# EAGLE schematic GabozePocaio (EAGLE 9.0.0)
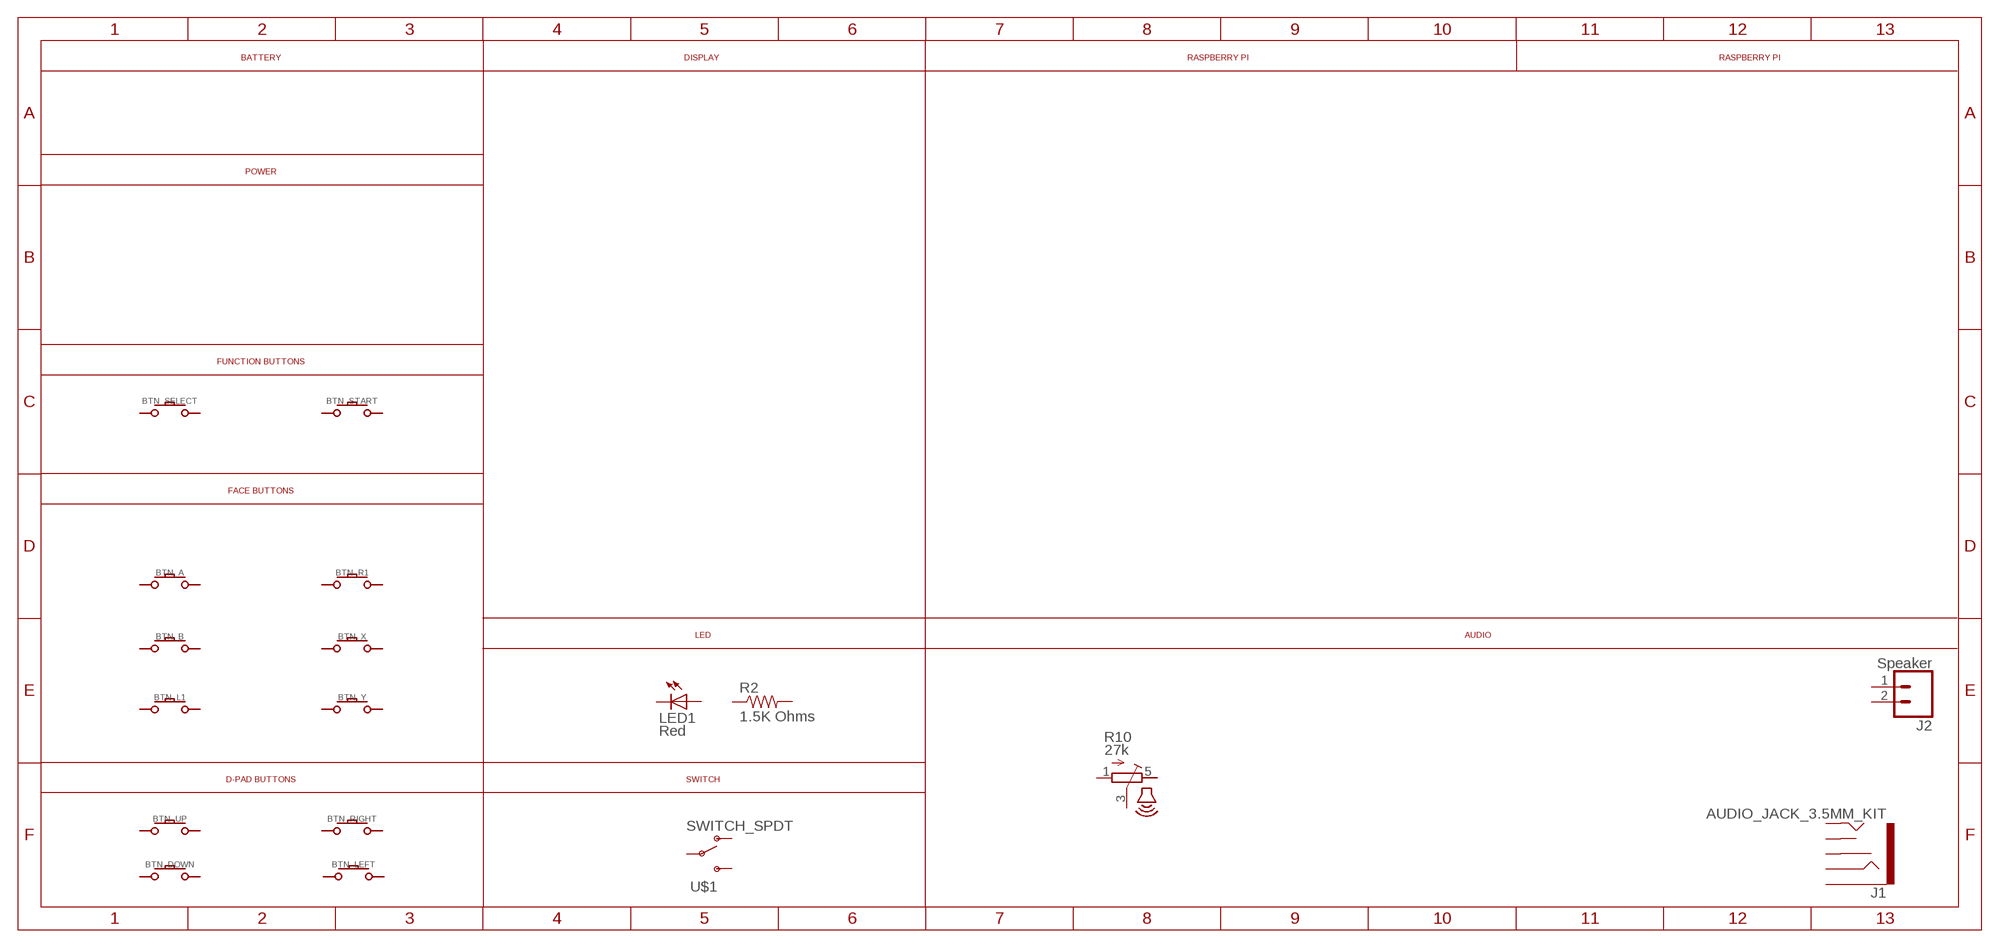
[diagram p0: schematic, sheet 1]

## Parts
BTN_A  GAMEBOY-ZERO-BUTTON  [GAMEBOY-ZERO-BUTTON]
BTN_B  GAMEBOY-ZERO-BUTTON  [GAMEBOY-ZERO-BUTTON]
BTN_DOWN  GAMEBOY-ZERO-BUTTON  [GAMEBOY-ZERO-BUTTON]
BTN_L1  GAMEBOY-ZERO-BUTTON  [GAMEBOY-ZERO-BUTTON]
BTN_LEFT  GAMEBOY-ZERO-BUTTON  [GAMEBOY-ZERO-BUTTON]
BTN_R1  GAMEBOY-ZERO-BUTTON  [GAMEBOY-ZERO-BUTTON]
BTN_RIGHT  GAMEBOY-ZERO-BUTTON  [GAMEBOY-ZERO-BUTTON]
BTN_SELECT  GAMEBOY-ZERO-BUTTON  [GAMEBOY-ZERO-BUTTON]
BTN_START  GAMEBOY-ZERO-BUTTON  [GAMEBOY-ZERO-BUTTON]
BTN_UP  GAMEBOY-ZERO-BUTTON  [GAMEBOY-ZERO-BUTTON]
BTN_X  GAMEBOY-ZERO-BUTTON  [GAMEBOY-ZERO-BUTTON]
BTN_Y  GAMEBOY-ZERO-BUTTON  [GAMEBOY-ZERO-BUTTON]
J1  AUDIO_JACK_3.5MM_KIT  [AUDIO-JACK-KIT]
J2  Speaker  CONN_02  [1X02]
LED1  Red  LEDCHIPLED_0805  [CHIPLED_0805]
R2  1.5K Ohms  R-US_R0805  [R0805]
R10  27k  VOLUME  [VOLUME]
U$1  SWITCH_SPDT  [KPS-1290]
Unconnected: BTN_A.P$ACTIVE BTN_A.P$GND BTN_B.P$ACTIVE BTN_B.P$GND BTN_DOWN.P$ACTIVE BTN_DOWN.P$GND BTN_L1.P$ACTIVE BTN_L1.P$GND BTN_LEFT.P$ACTIVE BTN_LEFT.P$GND BTN_R1.P$ACTIVE BTN_R1.P$GND BTN_RIGHT.P$ACTIVE BTN_RIGHT.P$GND BTN_SELECT.P$ACTIVE BTN_SELECT.P$GND BTN_START.P$ACTIVE BTN_START.P$GND BTN_UP.P$ACTIVE BTN_UP.P$GND BTN_X.P$ACTIVE BTN_X.P$GND BTN_Y.P$ACTIVE BTN_Y.P$GND J1.RING J1.RSH J1.SLEEVE J1.TIP J1.TSH J2.1 J2.2 LED1.A LED1.C R2.1 R2.2 R10.1(A) R10.3(S) R10.5(E) U$1.O U$1.P U$1.S

## Notes on the sheet
- BATTERY | DISPLAY | RASPBERRY PI | RASPBERRY PI
- POWER
- FUNCTION BUTTONS
- FACE BUTTONS
- LED | AUDIO
- D-PAD BUTTONS | SWITCH

## Library data of the parts
BTN_A BTN_B BTN_DOWN BTN_L1 BTN_LEFT BTN_R1 BTN_RIGHT BTN_SELECT BTN_START BTN_UP BTN_X BTN_Y = GameboyZeroButtonLibrary:GAMEBOY-ZERO-BUTTON
J1 = SparkFun-Connectors:AUDIO_JACK_3.5MM: Audio Jack 3.5mm variants of PTH and SMT stereo audio jack with bypass switches. SparkFun Products: SparkFun SparkPunk Sound Kit <[https://www.sparkfun.com/products/11177]> - PTH MP3 Trigger <https://www.sparkfun.com/products/13720> -3.5mm SMD SparkFun PicoBoard <https://www.sparkfun.com/products/11888>- 2.5mm SMD; PROD_ID: CONN-08774; SF_ID: PRT-08032
J2 = SparkFun-Connectors:CONN_02: Multi connection point. Often used as Generic Header-pin footprint for 0.1 inch spaced/style header connections On any of the 0.1 inch spaced packages, you can populate with these: Break Away Headers - Straight <https://www.sparkfun.com/products/116> (PRT-00116) Break Away Male Headers - Right Angle <https://www.sparkfun.com/products/553> (PRT-00553) Female Headers <https://www.sparkfun.com/products/115> (PRT-00115) Break Away Headers - Machine Pin <https://www.sparkfun.com/products/117> (PRT-00117) Break Away Female Headers - Swiss Machine Pin <https://www.sparkfun.com/products/743> (PRT-00743) For SCREWTERMINALS and SPRING TERMINALS visit here: Screw Terimnals on SparkFun.com <https://www.sparkfun.com/search/results?term=Screw+Terminals> (5mm/3.5mm/2.54mm spacing) This device is also useful as a general connection point to wire up your design to another part of your project. Our various solder wires solder well into these plated through hole pads. Hook-Up Wire - Assortment (Stranded, 22 AWG) <https://www.sparkfun.com/products/11375> (PRT-11375) Hook-Up Wire - Assortment (Solid Core, 22 AWG) <https://www.sparkfun.com/products/11367> (PRT-11367) View the entire wire category on our website here <https://www.sparkfun.com/categories/141> Special notes: Molex polarized connector foot print use with: PRT-08233 with associated crimp pins and housings. 2.54_SCREWTERM for use with PRT-10571. 3.5mm Screw Terminal footprints for PRT-08084 5mm Screw Terminal footprints for use with PRT-08432
LED1 = adafruit:LED: LED OSRAM: - CHIPLED LG R971, LG N971, LY N971, LG Q971, LY Q971, LO R971, LY R971 LH N974, LH R974 LS Q976, LO Q976, LY Q976 LO Q996 - Hyper CHIPLED LW Q18S LB Q993, LB Q99A, LB R99A - SideLED LS A670, LO A670, LY A670, LG A670, LP A670 LB A673, LV A673, LT A673, LW A673 LH A674 LY A675 LS A676, LA A676, LO A676, LY A676, LW A676 LS A679, LY A679, LG A679 - Hyper Micro SIDELED® LS Y876, LA Y876, LO Y876, LY Y876 LT Y87S - SmartLED LW L88C, LW L88S LB L89C, LB L89S, LG L890 LS L89K, LO L89K, LY L89K LS L896, LA L896, LO L896, LY L896 - TOPLED LS T670, LO T670, LY T670, LG T670, LP T670 LSG T670, LSP T670, LSY T670, LOP T670, LYG T670 LG T671, LOG T671, LSG T671 LB T673, LV T673, LT T673, LW T673 LH T674 LS T676, LA T676, LO T676, LY T676, LB T676, LH T676, LSB T676, LW T676 LB T67C, LV T67C, LT T67C, LS T67K, LO T67K, LY T67K, LW E67C LS E67B, LA E67B, LO E67B, LY E67B, LB E67C, LV E67C, LT E67C LW T67C LS T679, LY T679, LG T679 LS T770, LO T770, LY T770, LG T770, LP T770 LB T773, LV T773, LT T773, LW T773 LH T774 LS E675, LA E675, LY E675, LS T675 LS T776, LA T776, LO T776, LY T776, LB T776 LHGB T686 LT T68C, LB T68C - Hyper Mini TOPLED® LB M676 - Mini TOPLED Santana® LG M470 LS M47K, LO M47K, LY M47K Source: http://www.osram.convergy.de/
R2 = adafruit:R-US_: RESISTOR, American symbol
R10 = GBA:VOLUME
U$1 = SparkFun-Retired:SWITCH_SPDT: SWCH-10651 Side-actuated SPDT slide switch, as used on the Arduino Pro; PROD_ID: SWCH-10651